# Altium schematic sheet Drive.SchDoc
size A4
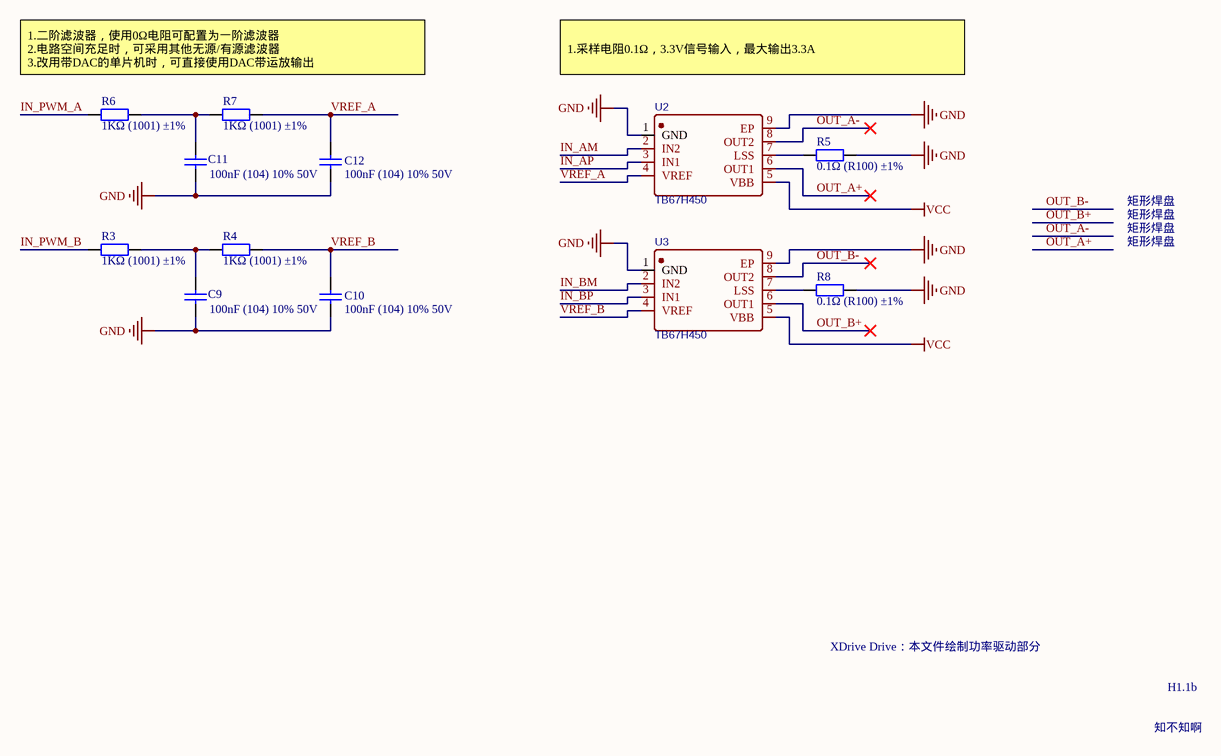
[diagram p0: Drive.SchDoc]

## Parts
C9  100nF (104) 10% 50V  [0603_C]
C10  100nF (104) 10% 50V  [0603_C]
C11  100nF (104) 10% 50V  [0603_C]
C12  100nF (104) 10% 50V  [0603_C]
R3  1KΩ (1001) ±1%  [0603_R]
R4  1KΩ (1001) ±1%  [0603_R]
R5  0.1Ω (R100) ±1%  [1206_R]
R6  1KΩ (1001) ±1%  [0603_R]
R7  1KΩ (1001) ±1%  [0603_R]
R8  0.1Ω (R100) ±1%  [1206_R]
U2  TB67H450  [SOIC-8_EP_150MIL]
U3  TB67H450  [SOIC-8_EP_150MIL]

## Nets
GND: C9.1 C10.1 C11.1 C12.1 R5.2 R8.2 U2.1(GND) U2.9(EP) U3.1(GND) U3.9(EP)
VCC: U2.5(VBB) U3.5(VBB)
IN_AM: U2.2(IN2)
IN_AP: U2.3(IN1)
IN_BM: U3.2(IN2)
IN_BP: U3.3(IN1)
IN_PWM_A: R6.1
IN_PWM_B: R3.1
OUT_A+: U2.6(OUT1)
OUT_A-: U2.8(OUT2)
OUT_B+: U3.6(OUT1)
OUT_B-: U3.8(OUT2)
VREF_A: C12.2 R7.2 U2.4(VREF)
VREF_B: C10.2 R4.2 U3.4(VREF)
NetC9_2: C9.2 R3.2 R4.1
NetC11_2: C11.2 R6.2 R7.1
NetR5_1: R5.1 U2.7(LSS)
NetR8_1: R8.1 U3.7(LSS)

## Notes on the sheet
- 1.二阶滤波器，使用0Ω电阻可配置为一阶滤波器
  2.电路空间充足时，可采用其他无源/有源滤波器
  3.改用带DAC的单片机时，可直接使用DAC带运放输出
- 1.采样电阻0.1Ω，3.3V信号输入，最大输出3.3A
- 矩形焊盘
- XDrive Drive：本文件绘制功率驱动部分
- H1.1b
- 知不知啊

## Library data of the parts
C9-C12 = 0603 100nF (104) 10% 50V: 贴片电容; ComponentLink1Description: 供应商链接; ComponentLink1URL: http://www.szlcsc.com/product/details_15331.html; Package: 0603; Supplier: LC; SuppliersPartNumber: C14663
R3 R4 R6 R7 = 0603 1KΩ (1001) 1%: 贴片电阻; ComponentLink1Description: 供应商链接; ComponentLink1URL: http://www.szlcsc.com/product/details_21904.html; Package: 0603; Supplier: LC; SuppliersPartNumber: C21190
R5 R8 = 1206 0.1Ω (R100) 1%: 贴片电阻; ComponentLink1Description: 供应商链接; ComponentLink1URL: http://www.szlcsc.com/product/details_26077.html; Package: 1206; Supplier: LC; SuppliersPartNumber: C25334
U2 U3 = A4950ELJTR-T: 直流电机驱动器; BOM_Manufacturer: ALLEGRO; SMT Type: Extend; BOM_Supplier: LCSC; BOM_Manufacturer Part: A4950ELJTR-T; BOM_Supplier Part: C82404; BOM_LCSC Assembly: Yes; spicePre: U; spiceSymbolName: A4950ELJTR-T